# EAGLE design bike_light (EAGLE 9.1.1)
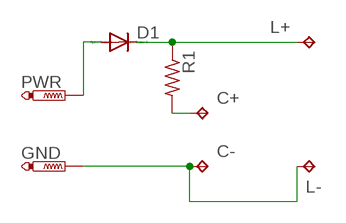
[diagram p0: schematic, sheet 1]

## Parts
C+  TPTP20SQ  [TP20SQ]
C-  TPTP20SQ  [TP20SQ]
D1  DIODE-DO-214AC  [DO-214AC]
GND  PTR1PAD1-13Y  [P1-13Y]
L+  TPTP20SQ  [TP20SQ]
L-  TPTP20SQ  [TP20SQ]
PWR  PTR1PAD1-13Y  [P1-13Y]
R1  R-US_M1206  [M1206]

## Nets
N$1: D1.C L+.TP R1.1
N$2: C+.TP R1.2
N$3: C-.TP GND.TP L-.TP
N$4: D1.A PWR.TP

## Library data of the parts
C+ C- L+ L- = testpad:TP: Test pad
D1 = diode:DIODE-: DIODE
GND PWR = testpad:PTR1: TEST PIN
R1 = rcl:R-US_: RESISTOR, American symbol

## Net classes
0 default: width 0.508 mm, drill 0.508 mm, clearance 0.508 mm

## Board
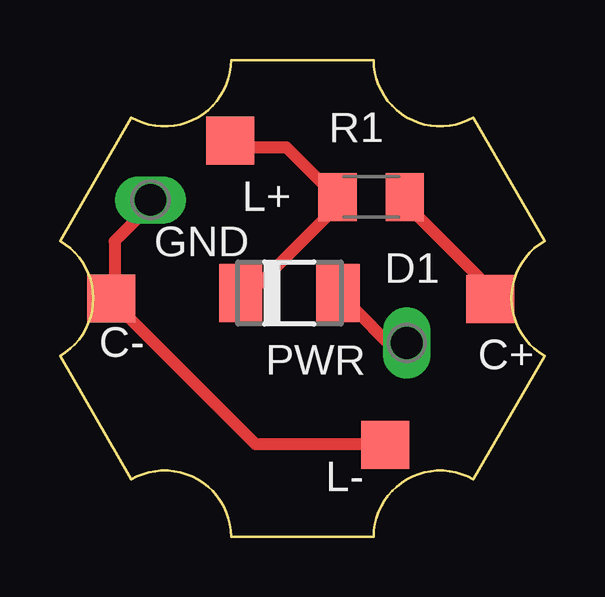
[diagram p1: board, top side]

Size 20.2 x 19.89 mm. Coordinates in mm from the lower left corner, seen from the top.
Outline: 13.07,19.89 7.13,19.89 arc-120 2.97,17.49 0,12.34 arc-120 0,7.55 2.97,2.4 arc-120 7.13,0 13.07,0 arc-120 17.22,2.4 20.2,7.55 arc-120 20.2,12.34 17.22,17.49 arc-120 13.07,19.89
Copper layers (1*16): Top 0.035mm / dielectric 1.5mm / Bottom 0.035mm
Design rules "OthermillDRC_1_32_v2": minimum track width 8mil, minimum drill 0.8mm, track to track 0.794003125mm, track to pad 0.794003125mm, pad to pad 0.794003125mm, via to via 0.794003125mm, smd to smd 0mil, copper to edge 0mil, drill to drill 1mil, minimum pad ring 10mil, minimum via ring 10mil, stop-mask expansion 1mil, vias tented up to drill 30mil, thermal gap 10mil

### Footprints (pad centres in the part's own frame; a part is rotated, then mirrored left to right if it is on the bottom)
TP20SQ = smd 2 x 2: TP 0,0
DO-214AC = smd 1.8 x 2.4: A 2.025,0; C -2.025,0
P1-13Y = drill 1.321 pad 1.905 long: TP 0,0
M1206 = smd 1.6 x 2: 1 -1.4,0; 2 1.4,0

### Placement (x,y rotation side)
C+  17.92,9.92 0 top
C-  2.13,9.94 0 top
D1  9.56,10.17 0 top
GND  3.77,14.05 90 top
L+  7.09,16.52 0 top
L-  13.56,3.84 0 top
PWR  14.45,8.09 0 top
R1  12.97,14.18 0 top

### Tracks (layer width: path | path; a pad name or v marks a point on that pad's centre or on a via)
N$1
  Top 0.508: L+.TP 7.49,16.24 9.44,16.24 11.39,14.29 R1.1 11.39,13.64 8.14,10.38 D1.C
N$2
  Top 0.508: C+.TP 17.9,10.38 14.65,13.64 R1.2
N$3
  Top 0.508: GND.TP 3.58,13.64 2.28,12.33 2.28,10.38 C-.TP 2.28,9.73 8.14,3.87 13.35,3.87 L-.TP
N$4
  Top 0.508: D1.A 12.04,9.73 14,7.78 PWR.TP